# EasyEDA schematic SCH_VoltageRegulator_2021-10-04.json
TITLE: VOLTAGE REGULATOR; REV: 1.0; Date: 2021-10-04; Sheet: 1/1; Drawn By: Aryaman Mishra; Company: 19BCE1027
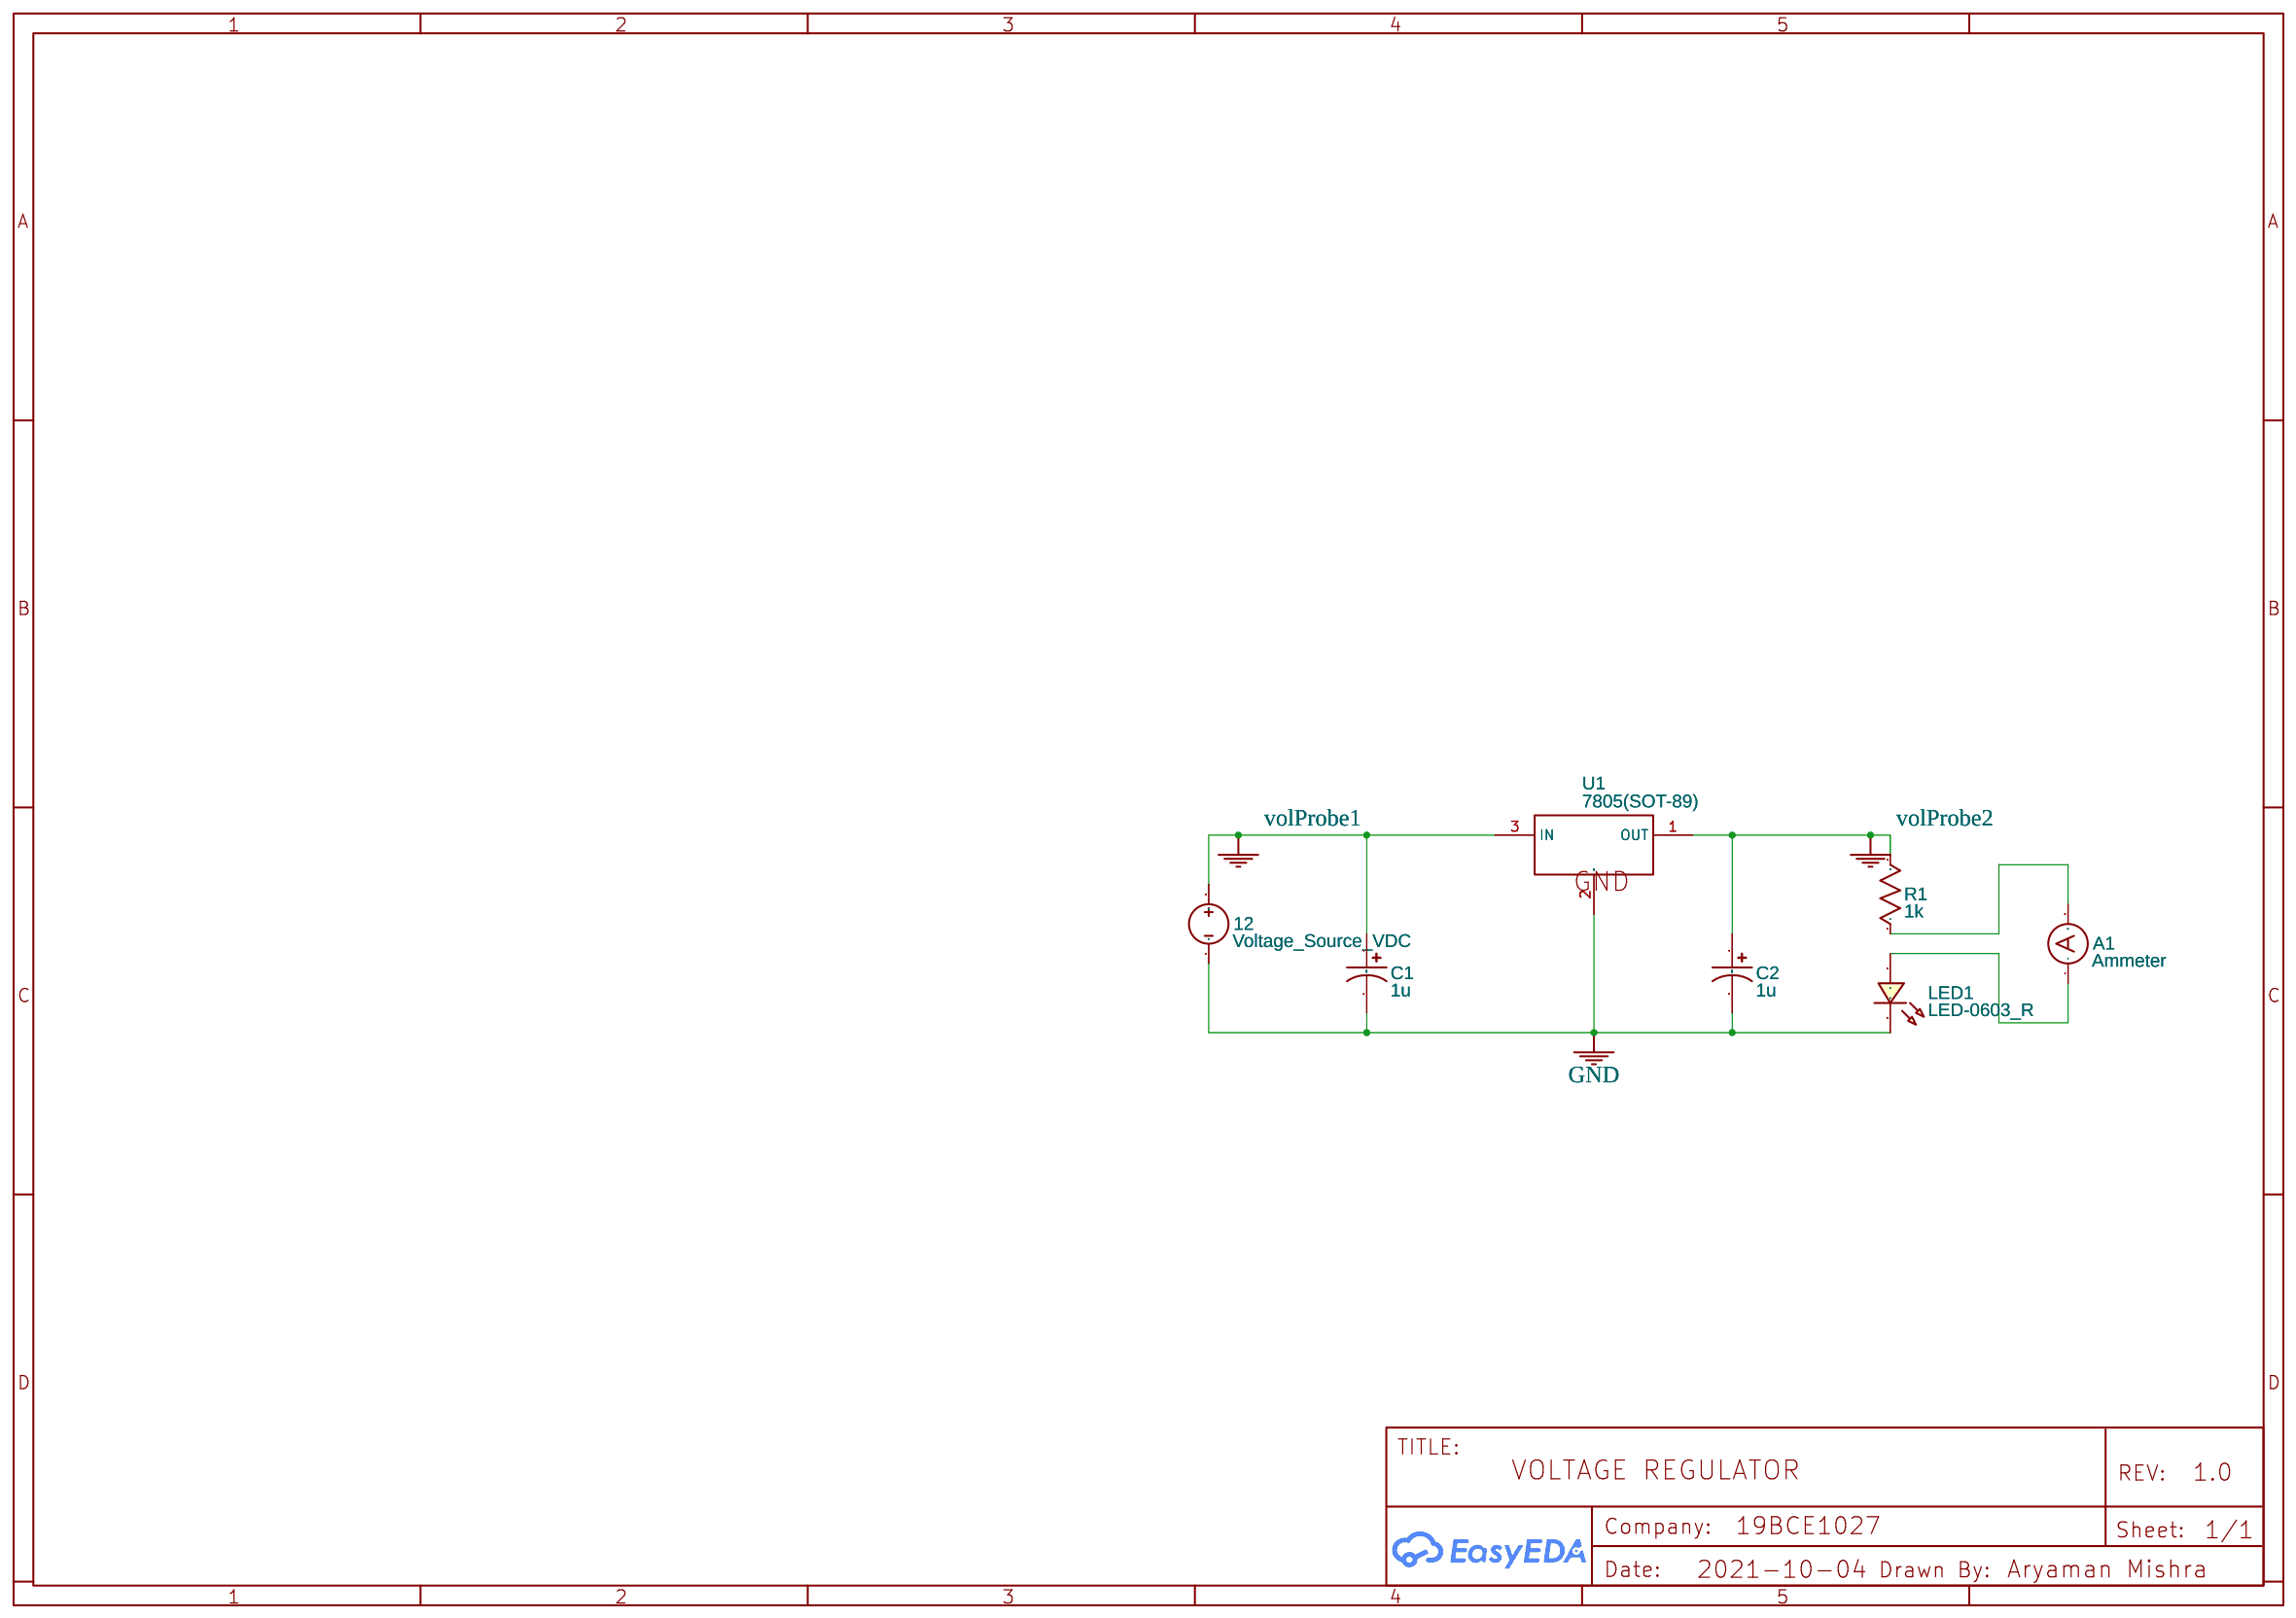
[diagram p0: schematic sheet]

## Parts
12  Voltage_Source_VDC  [HDR1X2]
A1  Ammeter
C1  1u  [CAP-D4.0×H5.5]
C2  1u  [CAP-D4.0×H5.5]
LED1  LED-0603_R  [LED0603_RED]
R1  1k  [R0603]
U1  7805(SOT-89)  [SOT-89-3_L4.5-W2.5-P1.50-LS4.2-BR]

## Library data of the parts
12 = VDC: Contributor: EasyEDA; sim: true; Package Display: No
A1 = Ammeter
C1 C2 = CE_SMD_D4.0×H5.5_US: Contributor: LCEDA_Lib
LED1 = LED-0603_R: Manufacturer: EVERLIGHT(台湾亿光); Manufacturer Part: 19-217/R6C-AL1M2VY/3T; Supplier Part: C72044; Supplier: LCSC; Contributor: LCEDA_01
R1 = R_0603_US: Contributor: LCEDA_Lib
U1 = 7805(SOT-89): Supplier: LCSC; Manufacturer: CJ; Manufacturer Part: CJ78L05; image: //image.lceda.cn/szlcsc/C2079.jpg; Supplier Part: C2079; Paste Type: expand; Contributor: LCEDA_Lib

## Nets
GND: 12.2 C1.2 C2.2 LED1.2 U1.2(GND)
volProbe1: 12.1 C1.1 U1.3(IN)
volProbe2: C2.1 R1.2 U1.1(OUT)
Net-(A1-1): A1.1(+) LED1.1
Net-(A1-2): A1.2 R1.1
